# Altium schematic sheet Li-ion.SchDoc: Li-ion battery.
size 297 x 209 mm; Author: Dmitry Shpakov; Organization: NoName; Revision: Revision; SheetNumber: 8; SheetTotal: 11; PageSize: A4; ProjectName: Project Name
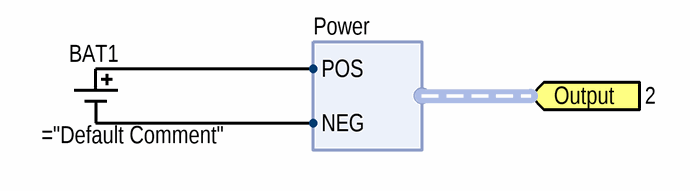
[diagram p0: Li-ion.SchDoc]

## Parts
BAT1  (no value)

## Ports
Output (in, harness Power, see 2)

## Harnesses
Power: POS, NEG

## Nets
NetBAT1_NEG: BAT1.NEG ; port Output.NEG
NetBAT1_POS: BAT1.POS ; port Output.POS

## Notes on the sheet
- Author
- Date
- Organization
- Page
- Total pages
- Materials
- Page size

## Library data of the parts
BAT1 = S2B-PH-K-S(LF)(SN): CONN HEADER R/A 2POS 2MM; Manufacturer: JST Sales America Inc.; Default Comment: JST-PH-2; Power Dissipation: * W; Rated Voltage: * V; Rated Current: * A; Tolerance: * %; Other: Connector Header Through Hole, Right Angle 2 position 0.079" (2.00mm); Operating Temperature: -25 °C to +85 °C; Type: connector; HelpURL: https://www.digikey.com/en/products/detail/jst-sales-america-inc/S2B-PH-K-S-LF-SN/926626; Rated Power: * W; Value: *; Summary: ="Type"+" "+"Part Number"+" "+"Manufacturer"+" "+"Value"+" "+"Tolerance"+" "+"Operating Temperature"+" "+"Case"+" "+"Power Dissipation"+" "+"Rated Current"+" "+"Rated Power"+" "+"Rated Voltage"+" "+"Other"; Assembly: *; Case: JST-PH-2; Part Number: S2B-PH-K-S(LF)(SN)